# EasyEDA Pro project 通用F405飞控_2025-10-30.epro, board PCB1
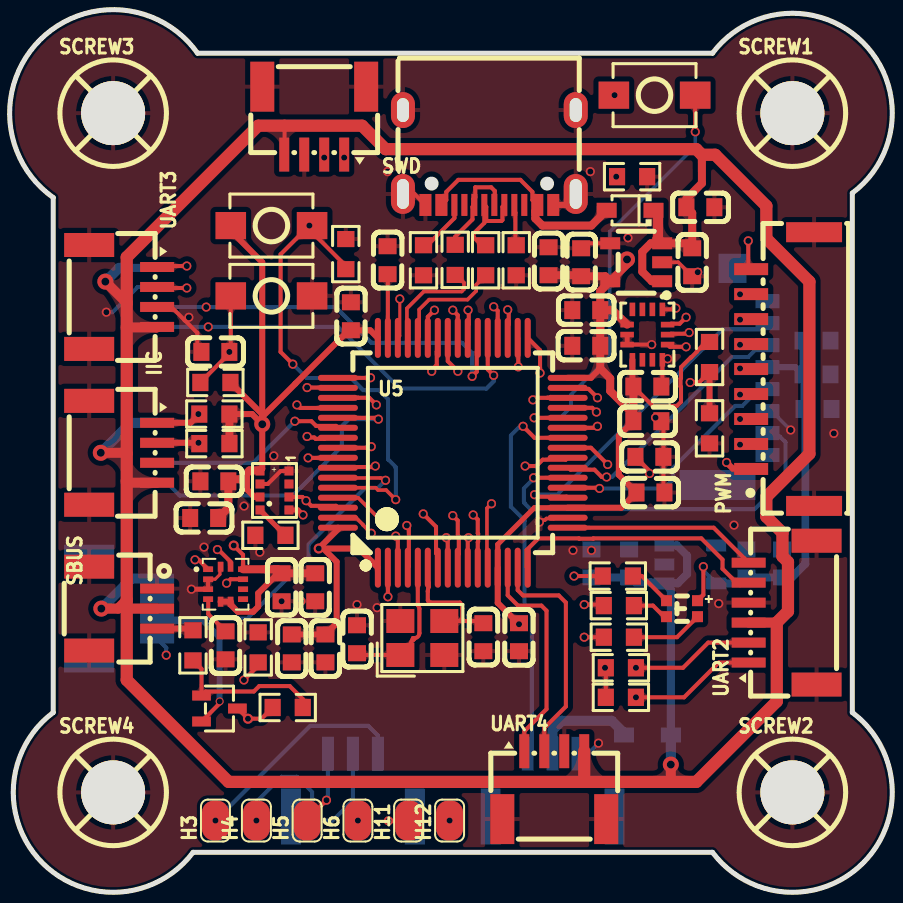
[diagram p5: board, top side]
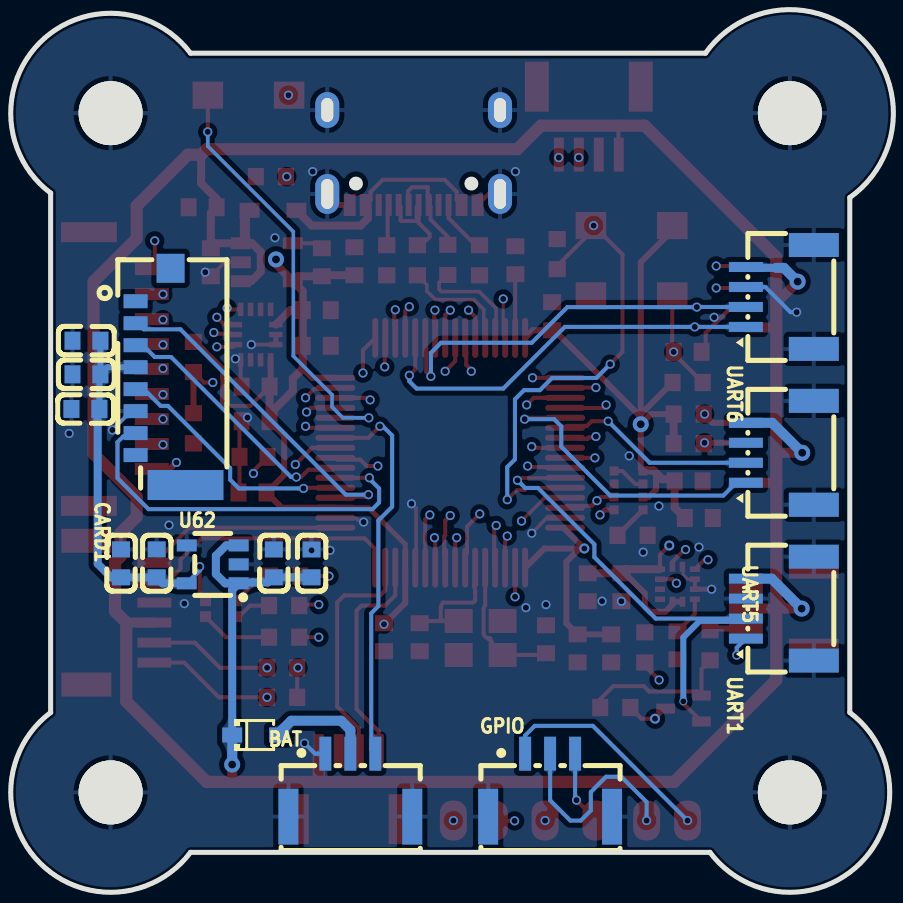
[diagram p6: board, bottom side, seen from below]

Outline 44.18 x 44.18 mm; copper layers: Top Layer, Inner1, Inner2, Bottom Layer. Coordinates in mm from the lower left corner of the outline.
Outline path: 2.18,34.77 arc(1.52,42.66) 9.41,42 35.18,42 arc(42.72,42.53) 42.18,35 42.18,9 arc(42.72,1.46) 35.18,2 9.18,2 arc(1.65,1.46) 2.18,9 2.18,34.77
Stack: Top Layer 0.035mm 外层铜厚1oz / Dielectric1 0.2104mm 7628 RC49% 8.6mil / Inner1 0.0152mm 内层铜厚 / Dielectric2 1.065mm 1.1mm H/HOZ Copper / Inner2 0.0152mm 内层铜厚 / Dielectric3 0.2104mm 7628 RC49% 8.6mil / Bottom Layer 0.035mm 外层铜厚1oz

## Design rules (mm)
net OSCOUT: DP1
net OSCIN: DP1
net OTG_FS_DM: DP3
net DM: DP2
net OTG_FS_DP: DP3
net DP: DP2
template: 自定义配置
spacing copperThickness1oz (default): track to track 0.102, other pairs 0.152 to 0.3
spacing copperThickness2oz: track to track 0.203, other pairs 0.152 to 0.3
track width copperThickness1oz (default): min 0.127, default 0.254, max 2.54
track width copperThickness2oz: min 0.203, default 0.254, max 2.54
differential pair differentialPair (default): width min 0.127, default 0.254, max 2.54; gap min 0.152, default 0.152
via viaSize (default): diameter min 0.254, default 0.457, max 10; hole min 0.3, default 0.305, max 6.299

## Placement (name value [footprint] x y rotation side)
BAT  WAFER-GH1.25-3PWB  [CONN-TH_3P-P1.25_GH1.25]  27.18 5.36 180 bottom
C1  10nF  [C0603]  28.87 29.14 0 top
C2  100nF  [C0603]  31.93 25.31 180 top
C3  2.2uF  [C0603]  31.93 23.58 180 top
C8  1uF  [C0603]  13.62 15.26 90 top
C9  100nF  [C0603]  15.3 15.26 90 top
C10  100nF  [C0603]  10.81 12.36 90 top
C12  100nF  [C0603]  17.08 28.83 270 top
C13  100nF  [C0603]  14.13 12.2 90 top
C14  100nF  [C0603]  15.81 12.2 90 top
C15  100nF  [C0603]  25.5 12.76 90 top
C16  100nF  [C0603]  32.08 20.01 180 top
C17  100nF  [C0603]  28.87 27.35 0 top
C20  2.2uF  [C0603]  18.92 31.63 270 top
C21  2.2uF  [C0603]  32.03 21.79 180 top
C42  30pF  [C0603]  23.71 12.76 270 top
C52  100nF  [C0603]  10.3 27.04 180 top
C70  30pF  [C0603]  17.39 12.66 270 top
C77  100nF  [C0603]  40.44 24.19 0 bottom
C78  100nF  [C0603]  34.17 31.53 90 top
C79  100nF  [C0603]  26.98 31.58 270 top
C80  10uF  [C0603]  28.61 31.53 270 top
C81  10uF  [C0603]  34.58 34.29 180 top
C82  100nF  [C0603]  29.13 16.46 270 bottom
C83  100nF  [C0603]  38.66 16.46 270 bottom
C84  10uF  [C0603]  36.88 16.46 270 bottom
C85  10uF  [C0603]  31.01 16.46 270 bottom
C86  100nF  [C0603]  9.74 18.73 0 top
C87  100nF  [C0603]  10.25 20.57 0 top
C88  100nF  [C0603]  40.39 25.92 180 bottom
C89  100nF  [C0603]  40.39 27.61 180 bottom
CARD1  TF-021B-H265  [TF-SMD_TF-021B-H265]  36.68 25.81 90 bottom
D1  1N5819WS  [SOD-323_L1.8-W1.3-LS2.5-RD]  31.93 7.87 180 bottom
D2  1N5819WS  [SOD-323_L1.8-W1.3-LS2.5-RD]  31.06 34.13 180 top
GPIO  WAFER-GH1.25-3PWB  [CONN-TH_3P-P1.25_GH1.25]  17.18 5.36 180 bottom
H3  -  [飞控微型焊盘]  10.3 3.59 90 top
H4  -  [飞控微型焊盘]  12.35 3.59 90 top
H5  -  [飞控微型焊盘]  14.89 3.59 90 top
H6  -  [飞控微型焊盘]  17.43 3.59 90 top
H11  -  [飞控微型焊盘]  19.97 3.59 90 top
H12  -  [飞控微型焊盘]  22.02 3.59 90 top
IIC  ZX-SH1.0-4PWT  [CONN-SMD_4P-P1.00_MEGASTAR_ZX-SH1.0-4PWT]  5.68 22 270 top
LED1  XL-2012RGBC  [LED-SMD_4P-L2.0-W1.3-BR]  33.66 14.19 0 top
PWM  WAFER-GH1.25-9PWB  [CONN-SMD_9P-P1.25_XUNPU_WAFER-GH1.25-9PWB]  38.69 26.19 90 top
Q1  SS8550(RANGE:200-350)  [SOT-323-3_L2.0-W1.3-P1.30-LS2.1-BR]  10.51 9.19 180 top
R1  10kΩ  [R0603]  16.83 31.94 90 top
R2  10kΩ  [R0603]  10.3 25.51 180 top
R3  1kΩ  [R0603]  31.16 35.82 0 top
R5  4.7kΩ  [R0603]  10.25 22.45 0 top
R6  4.7kΩ  [R0603]  10.25 23.93 0 top
R7  4.7kΩ  [R0603]  30.6 11.23 180 top
R8  4.7kΩ  [R0603]  30.6 9.76 180 top
R10  1kΩ  [R0603]  12.44 12.25 270 top
R12  150Ω  [R0603]  30.5 12.76 0 top
R13  150Ω  [R0603]  30.5 14.35 0 top
R14  150Ω  [R0603]  30.45 15.82 0 top
R19  5.1kΩ  [R0603]  20.72 31.63 90 top
R20  5.1kΩ  [R0603]  25.36 31.63 90 top
R21  1kΩ  [R0603]  13.92 9.25 0 top
R22  1kΩ  [R0603]  9.18 12.36 270 top
R23  22Ω  [R0603]  23.83 31.63 270 top
R24  22Ω  [R0603]  22.31 31.65 270 top
R25  10kΩ  [R0603]  13.06 17.86 0 top
R28  10kΩ  [R0603]  35.04 23.22 90 top
R29  1kΩ  [R0603]  35.04 26.79 270 top
SBUS  WAFER-SH1.0-3PWB  [CONN-SMD_3P-P1.00_WAFER-SH1.0-3PWB]  5.68 14.2 270 top
SCREW1  -  [M3螺丝]  39.18 39 0 top
SCREW2  -  [M3螺丝]  39.18 5 0 top
SCREW3  -  [M3螺丝]  5.18 39 0 top
SCREW4  -  [M3螺丝]  5.18 5 0 top
SW1  TS342A2P-WZ  [SW-SMD_L4.0-W2.9-LS5.0]  13.11 29.85 180 top
SW2  TS342A2P-WZ  [SW-SMD_L4.0-W2.9-LS5.0]  13.11 33.37 0 top
SW3  TS342A2P-WZ  [SW-SMD_L4.0-W2.9-LS5.0]  32.28 39.9 0 top
SWD  ZX-SH1.0-4PWT  [CONN-SMD_4P-P1.00_MEGASTAR_ZX-SH1.0-4PWT]  15.25 38.62 180 top
Typec  TYPE-C 16PIN 2MD(073)  [USB-C-SMD_TYPE-C-6PIN-2MD-073]  24.01 36.78 180 top
U1  ICM-42688-P  [LGA-14_L3.0-W2.5-P0.50-TL]  31.93 27.91 270 top
U4  LIS3MDLTR  [LGA-12_L2.0-W2.0-P0.50-BL]  10.81 15.42 270 top
U5  STM32F405RGT6  [LQFP-64_L10.0-W10.0-P0.50-LS12.0-BL]  22.18 22 0 top
U61  ME6217C33M5G  [SOT-23-5_L3.0-W1.7-P0.95-LS2.8-BR]  31.36 31.53 0 top
U62  ME6217C33M5G  [SOT-23-5_L3.0-W1.7-P0.95-LS2.8-BR]  34.07 16.41 180 bottom
U63  SPL06-001  [SENSOR-SMD_SPL06-001]  13.26 20.11 90 top
UART1  ZX-SH1.0-4PWT  [CONN-SMD_4P-P1.00_MEGASTAR_ZX-SH1.0-4PWT]  5.68 14.2 90 bottom
UART2  ZX-SH1.0-6PWT  [CONN-SMD_6P-P1.00_MEGASTAR_ZX-SH1.0-6PWT]  38.69 13.99 90 top
UART3  ZX-SH1.0-4PWT  [CONN-SMD_4P-P1.00_MEGASTAR_ZX-SH1.0-4PWT]  5.68 29.8 270 top
UART4  ZX-SH1.0-4PWT  [CONN-SMD_4P-P1.00_MEGASTAR_ZX-SH1.0-4PWT]  27.26 5.36 0 top
UART5  ZX-SH1.0-4PWT  [CONN-SMD_4P-P1.00_MEGASTAR_ZX-SH1.0-4PWT]  5.68 22 90 bottom
UART6  ZX-SH1.0-4PWT  [CONN-SMD_4P-P1.00_MEGASTAR_ZX-SH1.0-4PWT]  5.68 29.8 90 bottom
X3  12MHz  [CRYSTAL-SMD_4P-L3.2-W2.5-BL]  20.66 12.72 0 top

## Footprints (pads in the part's own frame, mm; a bottom-side part is the same pattern mirrored in y, then rotated)
C0603
  rect 0.8x0.9 smd: 1(-0.7,0) 2(0.7,0)
CONN-SMD_3P-P1.00_WAFER-SH1.0-3PWB
  rect 0.5x1.7 smd: 1(-1,1.7) 2(0,1.7) 3(1,1.7)
  rect 1.2x2.5 smd: 4(-2.1,-1.7) 5(2.1,-1.7)
CONN-SMD_4P-P1.00_MEGASTAR_ZX-SH1.0-4PWT
  rect 0.5x1.7 smd: 1(-1.5,1.7) 2(-0.5,1.7) 3(0.5,1.7) 4(1.5,1.7)
  rect 1.2x2.5 smd: 5(2.6,-1.7) 6(-2.6,-1.7)
CONN-SMD_6P-P1.00_MEGASTAR_ZX-SH1.0-6PWT
  rect 0.5x1.7 smd: 1(-2.5,1.7) 2(-1.5,1.7) 3(-0.5,1.7) 4(0.5,1.7) 5(1.5,1.7) 6(2.5,1.7)
  rect 1.2x2.5 smd: 7(3.6,-1.7) 8(-3.6,-1.7)
CONN-SMD_9P-P1.25_XUNPU_WAFER-GH1.25-9PWB
  rect 0.6x1.7 smd: 1(-5,1.575) 2(-3.75,1.575) 3(-2.5,1.575) 4(-1.25,1.575) 5(0,1.575) 6(1.25,1.575) 7(2.5,1.575) 8(3.75,1.575) 9(5,1.575)
  rect 1x2.8 smd: 10(6.85,-1.575) 11(-6.85,-1.575)
CONN-TH_3P-P1.25_GH1.25
  rect 0.6x1.7 smd: 1(-1.25,1.575) 2(0,1.575) 3(1.25,1.575)
  rect 1x2.8 smd: 4(3.1,-1.575) 5(-3.1,-1.575)
CRYSTAL-SMD_4P-L3.2-W2.5-BL
  rect 1.4x1.2 smd: 1(-1.1,-0.85) 2(1.1,-0.85) 3(1.1,0.85) 4(-1.1,0.85)
LED-SMD_4P-L2.0-W1.3-BR
  rect 0.55x0.55 smd: 1(0.775,-0.4) 2(-0.775,-0.4) 3(0.775,0.4) 4(-0.775,0.4)
LGA-12_L2.0-W2.0-P0.50-BL
  rect 0.28x0.5 smd: 1(-0.75,-0.875) 2(-0.25,-0.875) 3(0.25,-0.875) 4(0.75,-0.875) 7(0.75,0.875) 8(0.25,0.875) 9(-0.25,0.875) 10(-0.75,0.875)
  rect 0.5x0.28 smd: 5(0.875,-0.25) 6(0.875,0.25) 11(-0.875,0.25) 12(-0.875,-0.25)
LGA-14_L3.0-W2.5-P0.50-TL
  rect 0.675x0.28 smd: 1(-1.262,0.75) 2(-1.262,0.25) 3(-1.262,-0.25) 4(-1.262,-0.75) 8(1.262,-0.75) 9(1.262,-0.25) 10(1.262,0.25) 11(1.262,0.75)
  rect 0.28x0.675 smd: 5(-0.5,-1.012) 6(0,-1.012) 7(0.5,-1.012) 12(0.5,1.012) 13(0,1.012) 14(-0.5,1.012)
LQFP-64_L10.0-W10.0-P0.50-LS12.0-BL
  oval 0.3x2 smd: 1(-3.75,-5.75) 2(-3.25,-5.75) 3(-2.75,-5.75) 4(-2.25,-5.75) 5(-1.75,-5.75) 6(-1.25,-5.75) 7(-0.75,-5.75) 8(-0.25,-5.75) 9(0.25,-5.75) 10(0.75,-5.75) 11(1.25,-5.75) 12(1.75,-5.75) 13(2.25,-5.75) 14(2.75,-5.75) 15(3.25,-5.75) 16(3.75,-5.75) 33(3.75,5.75) 34(3.25,5.75) 35(2.75,5.75) 36(2.25,5.75) 37(1.75,5.75) 38(1.25,5.75) 39(0.75,5.75) 40(0.25,5.75) 41(-0.25,5.75) 42(-0.75,5.75) 43(-1.25,5.75) 44(-1.75,5.75) 45(-2.25,5.75) 46(-2.75,5.75) 47(-3.25,5.75) 48(-3.75,5.75)
  oval 2x0.3 smd: 17(5.75,-3.75) 18(5.75,-3.25) 19(5.75,-2.75) 20(5.75,-2.25) 21(5.75,-1.75) 22(5.75,-1.25) 23(5.75,-0.75) 24(5.75,-0.25) 25(5.75,0.25) 26(5.75,0.75) 27(5.75,1.25) 28(5.75,1.75) 29(5.75,2.25) 30(5.75,2.75) 31(5.75,3.25) 32(5.75,3.75) 49(-5.75,3.75) 50(-5.75,3.25) 51(-5.75,2.75) 52(-5.75,2.25) 53(-5.75,1.75) 54(-5.75,1.25) 55(-5.75,0.75) 56(-5.75,0.25) 57(-5.75,-0.25) 58(-5.75,-0.75) 59(-5.75,-1.25) 60(-5.75,-1.75) 61(-5.75,-2.25) 62(-5.75,-2.75) 63(-5.75,-3.25) 64(-5.75,-3.75)
M3螺丝
  round 3.2 hole 3.2: 1(0,0)
R0603
  rect 0.806x0.864 smd: 1(-0.753,0) 2(0.753,0)
SENSOR-SMD_SPL06-001
  rect 0.45x0.45 smd: 1(0.975,-0.725) 2(0.325,-0.725) 3(-0.325,-0.725) 4(-0.975,-0.725) 5(-0.975,0.725) 6(-0.325,0.725) 7(0.325,0.725) 8(0.975,0.725)
SOD-323_L1.8-W1.3-LS2.5-RD
  rect 1x0.75 smd: 1(-1.173,0) 2(1.173,0)
SOT-23-5_L3.0-W1.7-P0.95-LS2.8-BR
  rect 1x0.6 smd: 1(1.3,-0.95) 2(1.3,0) 3(1.3,0.95) 4(-1.3,0.95) 5(-1.3,-0.95)
SOT-323-3_L2.0-W1.3-P1.30-LS2.1-BR
  rect 0.936x0.5 smd: 1(0.898,-0.65) 2(0.898,0.65) 3(-0.898,0)
SW-SMD_L4.0-W2.9-LS5.0
  rect 1.53x1.36 smd: 1(-2.035,0) 2(2.035,0)
TF-SMD_TF-021B-H265
  rect 0.7x1.2 smd: 1(3.775,1.25) 2(2.675,1.25) 3(1.575,1.25) 4(0.475,1.25) 5(-0.625,1.25) 6(-1.725,1.25) 7(-2.825,1.25) 8(-3.925,1.25)
  rect 1.5x3.8 smd: 9(-5.425,-1.25)
  rect 1.45x1.4 smd: 10(5.425,-0.5)
USB-C-SMD_TYPE-C-6PIN-2MD-073
  rect 0.6x1.1 smd: 1(-3.2,2.375) 2(-2.4,2.375) 11(2.4,2.375) 12(3.2,2.375)
  rect 0.3x1.1 smd: 3(-1.75,2.375) 4(-1.25,2.375) 5(-0.75,2.375) 6(-0.25,2.375) 7(0.25,2.375) 8(0.75,2.375) 9(1.25,2.375) 10(1.75,2.375)
  oval 1.2x2 hole 0.6x1.5: 13(-4.325,1.825) 14(4.325,1.825)
  oval 1.2x1.8 hole 0.6x1.2: 13(-4.325,-2.375) 14(4.325,-2.375)
飞控微型焊盘
  rrect 2x1.35 smd: 1(0,0)

## Nets
As in the schematic.

Pads without a net: CARD1 1 8 9 10; Typec 3 9; U1 2 3 4 9 10; U4 7 8; U63 2

## Via types
v1: diameter 0.8, hole 0.4, Top Layer to Bottom Layer, 6 vias
v2: diameter 0.5, hole 0.3, Top Layer to Bottom Layer, 3 vias
v3: diameter 0.457, hole 0.305, Top Layer to Bottom Layer, 123 vias
v4: diameter 0.4, hole 0.299, Top Layer to Bottom Layer, 1 via

## Routing (per net, layer and track width the routed paths; a pad name or vN(x,y) marks a point on that pad's centre or on a via; arc(x,y) is an arc through that point)
3V3_MCU: length 152.1
  Top Layer w0.203: R21.1 12.61,8.68 v2(11.93,8.68) 11.42,9.19 11.4,9.19 ; R29.1 34.99,27.49 34.82,27.49 34.4,27.07 34.4,27.05 34.11,26.77 34.1,26.77 33.61,26.28 33.61,25.74 33.59,25.71 33.59,25.31 33.61,25.29 33.61,24.55 33.4,24.34 32.19,24.34 31.23,25.31 ; U4.10 11.69,16.89 v2(11.22,17.35) ; C16.2 31.38,20.15 ; R7.2 R8.2
  Top Layer w0.25: U5.19 26.27,19.25 24.43,17.41 U5.13
  Top Layer w0.3: U63.8 12.65,21.2 v1(12.65,23.42) ; 27.93,25.75 29.1,25.75 29.57,26.21 ; 12.65,23.79 14.31,25.45 14.31,25.46 16.98,28.13 C12.2 18.05,28.13 U5.48 ; 12.65,23.79 v1(12.65,23.42) ; 12.65,23.79 12.65,23.92 ; 15.7,17.2 v2(15.47,17.2) 16.43,18.17 U5.64 ; 15.7,17.2 17.48,17.2 U5.1 ; 15.7,17.2 16.37,16.54 16.37,13.46 C14.2 C13.2 ; SW2.1 11.07,33.11 12.65,31.53 12.65,23.92 ; v1(12.65,23.42) 12.14,23.93 R6.2 ; U63.6 12.26,19.78 11.88,20.16 11.88,20.98 ; v3(25.5,13.41) 24.43,14.48 U5.13 ; U4.5 U4.6 11.06,14.4 11.42,14.04 12.19,14.04 12.44,14.29 12.44,14.96 13.44,15.96 C8.2 ; 12.65,23.92 R2.1 ; U5.19 30.62,19.25 C16.2 30.5,20.89 30.5,22.85 31.23,23.58 ; 31.23,25.31 31.18,25.36 U1.8
  Top Layer w0.4: U4.10 13.41,16.17 C8.2 C9.2 ; 31.23,23.58 31.23,23.93 ; 31.23,23.93 30.06,25.09 30.06,25.72 29.57,26.21 C17.2 C1.2 ; 31.23,23.93 31.23,25.31 ; U61.5 30.91,31.43 v1(30.91,31.67) ; U61.5 29.81,30.83 C80.2 28.56,30.88 C79.2 ; U61.5 29.57,30.08 C1.2 ; U1.5 30.19,29.14 C1.2 ; U63.8 12.51,21.11 12.01,21.11 11.88,20.98 11.57,20.67 11.05,20.67 C87.2 10.95,19.24 C86.2 ; R6.2 R5.2
  Inner1 w0.3: v3(25.5,13.41) 26.84,13.41 28.36,11.9 29.14,11.9 v3(29.8,11.23) ; v1(12.65,23.42) 12.65,18.78 v2(11.22,17.35) ; v2(11.93,8.68) 15.47,12.22 v2(15.47,17.2)
  Inner1 w0.4: v1(12.65,23.42) 13.87,22.2 13.87,17.92 14.32,17.47 15.21,17.47 v2(15.47,17.2)
  Inner1 w0.5: v1(12.65,23.42) 12.65,26.38 18.31,32.04 30.44,32.04 30.81,31.67 v1(30.91,31.67)
3V3_PER: length 20.9
  Top Layer w0.203: 34.43,14.59 34.73,14.88 v3(34.73,16.3)
  Bottom Layer w0.203: v3(34.73,16.3) 34.73,16.11 U62.5
  Bottom Layer w0.3: CARD1.4 39.33,26.28 C88.2 ; C77.1 39.74,25.87 C88.2 ; C88.2 C89.2
  Bottom Layer w0.4: U62.5 36.58,15.46 C84.2 C83.2 39.15,15.76 39.83,16.44 39.83,24.1 C77.1
5V: length 173.6
  Top Layer w0.203: 13.76,38.37 13.76,36.94 SWD.4
  Top Layer w0.4: U61.1 32.15,30.58 31.67,31.06 31.67,32.05 32.1,32.48 U61.3 33.92,32.48 34.17,32.23 34.17,33.99 C81.2 33.88,34.71 34.65,35.49 34.65,36.91
  Top Layer w0.5: 33.08,5.52 33.1,5.54 v1(33.1,6.39) ; v1(4.57,22) 5.83,22 5.86,21.96 ; 5.86,20.56 5.93,20.5 IIC.4 ; UART3.4 7.36,28.27 5.86,28.27 ; U61.3 32.46,32.69 32.46,33.9 D2.1 ; SBUS.2 5.89,14.2 5.86,14.17 ; v1(4.59,14.2) 5.43,14.2 5.86,14.63 ; v1(4.79,30.56) 5.86,29.49 ; UART2.3 38.4,13.49
  Top Layer w0.61: 28.76,5.52 34.37,5.52 38.4,9.55 38.4,13.5 38.96,14.06 38.96,16.53 38.69,16.81 38.69,17.99 37.88,18.8 37.88,19.79 40.03,21.94 40.03,30.56 37.88,32.72 37.88,34.35 35.32,36.91 34.65,36.91 34.37,37.19 18.82,37.19 17.65,38.37 12.44,38.37 5.86,31.79 5.86,10.62 10.96,5.52 28.76,5.52 ; 28.76,5.52 UART4.4
  Bottom Layer w0.4: U62.1 33.45,15.46 33.91,15.93 33.91,16.84 33.4,17.36 U62.3 ; U62.1 32.73,15.5 32.08,15.5 32.07,15.51 31.32,15.51 31.06,15.76 C85.2 C82.2 ; U62.1 33.1,15.13 D1.1 ; UART6.4 7.34,31.25 5.86,31.25
  Bottom Layer w0.5: UART1.4 6.09,15.7 v1(4.59,14.2) ; v1(4.79,30.56) 5.48,31.25 5.86,31.25 ; v1(4.57,22) 6.07,23.5 UART5.4 ; D1.1 v1(33.1,6.39)
5V_USB: length 10.7
  Top Layer w0.203: Typec.2 26.17,34.65 26.17,35.06 25.57,35.66 22.46,35.66 21.86,35.06 21.86,34.65 Typec.11
  Top Layer w0.4: 26.32,34.09 26.32,34.09 26.32,33.73 26.67,33.37 29.12,33.37 D2.2
GND: length 33.4
  Top Layer w0.15: U4.2 10.29,15.67 10.53,15.91 10.53,16.15
  Top Layer w0.18: v3(18.1,17.97) 17.68,18.39 17.68,18.41 17.34,18.75 U5.63 ; v3(26.52,18.53) 26.62,18.63 26.79,18.63 26.87,18.71 27.25,18.71 27.29,18.75 27.93,18.75 U5.18 ; C78.1 33.47,31.53 U61.2 ; U5.12 23.89,16.29 23.89,19.22 v3(24.12,19.45)
  Top Layer w0.203: C3.1 32.73,23.47 32.73,20.06 C16.1 ; Typec.14 20.26,34.95 Typec.12 ; U1.7 v3(32.14,27.41) ; 8.77,28.63 8.14,29.26 7.68,29.26 7.64,29.3 UART3.3 ; 8.77,28.63 9.4,28 9.4,27.25 C52.2 ; 8.77,28.63 8.92,28.78 v3(8.98,28.78) ; 28.61,32.23 28.86,32.48 U61.4 ; C2.1 32.68,25.36 U1.11 32.89,26.65 v3(32.94,26.7) ; U63.7 12.92,20.43 13.57,21.08 U63.1 ; U4.2 U4.3
  Top Layer w0.25: U1.6 U1.7 ; v3(9.1,15.17) U4.3
  Top Layer w0.3: Typec.1 27.79,34.4 Typec.13
  Bottom Layer w0.18: 38.95,23.28 38.15,24.08 37.93,24.08
  Bottom Layer w0.203: UART6.3 6.41,30.3 5.15,29.03 v3(4.84,29.03) ; v3(29.48,7.46) 28.95,6.93 BAT.1
  vias: v3(9.73,17.27) v3(11.74,19.33) v3(12.53,17.02) v3(13.22,21.84) v3(13.62,14.56) v3(14.58,14.57) v3(17.39,14.4) v3(18.4,14.24) v3(18.92,36.07) v3(28.2,17.11) v3(29.07,36.07) v3(29.13,17.11) v3(30.96,32.76) v3(32.33,23.76) v3(34.45,31.04) v3(35.5,14.45) v3(36.26,18.37) v3(39.1,23.14) v3(41.26,22.96)
ADC1: length 19.7
  Top Layer w0.203: U5.26 26.28,22.75 v3(25.7,23.32)
  Bottom Layer w0.203: BAT.3 26.14,7.14 26.14,13.96 25.78,14.32 25.78,18.6 25.09,19.29 25.09,22.86 25.55,23.32 v3(25.7,23.32)
ADC2: length 10.3
  Top Layer w0.203: v3(29.43,23.32) 29.35,23.25 U5.27 ; v3(34.07,25.51) 34.51,25.51 R29.2
  Top Layer w0.3: R28.2 R29.2
  Inner1 w0.203: v3(34.07,25.51) 33.76,25.51 32.49,24.24 30.34,24.24 v3(29.43,23.32)
BOOT0: length 24.5
  Top Layer w0.18: v3(19.33,19.65) 18.85,20.13 18.44,20.13 18.33,20.25 U5.60
  Top Layer w0.203: v3(15.01,33.37) 13.57,31.93 13.57,27.04 v3(14.18,26.43) ; SW2.2 15.14,33.04 16.83,31.35 R1.1
  Bottom Layer w0.203: v3(14.18,26.43) 14.87,25.74 17.08,25.74 17.7,25.13 18.49,25.13 18.94,24.68 18.94,21.67 19.33,21.28 v3(19.33,19.65)
BUTTON1: length 21.9
  Top Layer w0.203: v3(34.32,38.06) 34.32,38.07 SW3.2 ; U5.28 v3(26.26,23.75)
  Bottom Layer w0.18: v3(26.26,23.75) 27.56,23.75 28.1,24.29 28.1,24.9 30.04,26.84 30.04,33.06 34.32,37.35 v3(34.32,38.06)
DM: length 5.1
  Top Layer w0.203: Typec.5 24.67,34.31 24.67,33.64 24.62,33.6 23.86,33.6 23.86,34.31 Typec.7 23.76,33.51 23.22,32.96 23.22,32.8 23.63,32.39 R23.1
DP: length 5.1
  Top Layer w0.203: Typec.6 24.26,34.5 24.29,34.53 24.29,35.1 24.1,35.29 23.31,35.29 23.31,34.79 23.21,34.7 23.21,34.45 Typec.8 23.17,34.31 23.17,33.68 22.31,32.81 R24.1
F5V: length 5.3
  Bottom Layer w0.5: D1.2 30.75,7.97 30.14,8.58 27.64,8.58 27.18,8.13 BAT.2
GPIO1: length 31.7
  Top Layer w0.203: U5.8 21.93,17.67 v3(21.86,17.75)
  Inner2 w0.203: v3(10.3,3.59) 21.86,15.14 v3(21.86,17.75)
  Bottom Layer w0.203: GPIO.1 18.43,7.84 17.95,8.33 15.05,8.33 v3(10.3,3.59)
GPIO2: length 32.8
  Top Layer w0.203: v3(22.18,18.85) 22.43,18.6 22.43,17.86 22.49,17.81 22.49,16.93 22.43,16.88 U5.9
  Inner2 w0.203: v3(12.35,3.59) 22.43,13.67 22.43,17.76 22.34,17.85 22.34,17.95 22.18,18.1 v3(22.18,18.85)
  Bottom Layer w0.203: GPIO.2 17.18,4.6 16.17,3.59 15.65,3.59 15.15,4.09 15.15,5.01 14.38,5.78 13.62,5.78 12.35,4.52 v3(12.35,3.59)
GPIO3: length 21.4
  Top Layer w0.203: v3(15.86,4.61) 14.89,3.64 H5.1 ; v3(22.97,17.75) 22.93,17.71 U5.10
  Inner2 w0.203: v3(22.97,17.75) 22.97,11.71 v3(15.86,4.61)
  Bottom Layer w0.203: v3(15.86,4.61) 15.93,4.68 GPIO.3
GPIO4: length 20.6
  Top Layer w0.203: U5.11 23.43,17.53 23.45,17.55 23.45,17.95 23.43,17.97 23.43,18.65 v3(23.2,18.88)
  Inner2 w0.203: v3(23.2,18.88) 23.2,18.2 23.45,17.95 23.45,9.61 v3(17.43,3.59)
GPIO5: length 24.9
  Top Layer w0.203: v3(18.96,3.57) 19.96,3.57 H11.1 ; v3(25.81,21.33) 26.37,21.33 26.68,21.65 27.84,21.65 U5.24
  Inner2 w0.203: v3(25.81,21.33) 25.09,20.62 25.09,15.57 26.32,14.35 26.32,10.93 v3(18.96,3.57)
GPIO6: length 24
  Top Layer w0.203: v3(29.94,21.41) 29.1,22.25 U5.25
  Inner2 w0.203: v3(22.02,3.59) 27.69,9.25 27.69,20.16 28.94,21.41 v3(29.94,21.41)
I2C1_SCL: length 28.8
  Top Layer w0.18: U5.61 17.45,19.75 v3(18.61,18.58)
  Top Layer w0.203: U4.1 9.46,16.64 v3(9.28,16.64)
  Top Layer w0.25: U63.4 14.44,19.13 v3(14.69,18.88)
  Top Layer w0.3: IIC.2 v3(9.46,22.5) R5.1
  Inner1 w0.25: v3(14.69,18.88) 18.31,18.88 v3(18.61,18.58)
  Inner1 w0.3: v3(9.46,22.5) 9.2,22.24 9.2,17.05 9.28,16.97 v3(9.28,16.64)
  Inner2 w0.203: v3(18.61,18.58) 16.83,20.36 14.53,20.36 14.28,20.11 11.63,20.11 9.23,17.71 9.23,16.69 v3(9.28,16.64)
I2C1_SDA: length 19.7
  Top Layer w0.203: v3(10.4,17.15) 10.45,17.15 11.06,16.54 U4.11 ; U63.3 14.66,19.78 v3(14.84,19.6) 15.1,19.34 16.34,19.34 U5.62
  Top Layer w0.3: R6.1 9.06,23.5 IIC.1
  Inner1 w0.3: v3(9.45,23.93) 10.4,22.98 v3(10.4,17.15)
  Inner2 w0.203: v3(10.4,17.15) 10.3,17.25 10.3,18.02 10.86,18.58 13.92,18.58 14.1,18.76 14.1,19.14 14.62,19.65 14.79,19.65 v3(14.84,19.6)
I2C2_SCL: length 21.8
  Top Layer w0.203: v3(29.38,24.04) 29.17,24.25 U5.29 ; v3(31.35,11.23) 33.71,11.23 34.97,12.49 UART2.2
  Inner2 w0.203: v3(31.35,11.23) 31.35,22.93 30.24,24.04 v3(29.38,24.04)
I2C2_SDA: length 26.1
  Top Layer w0.203: v3(26.19,24.64) 26.3,24.75 26.91,24.75 26.92,24.75 27.93,24.75 U5.30 ; v3(31.35,9.76) 33.76,9.76 35.5,11.49 UART2.1
  Inner2 w0.203: v3(26.19,24.64) 28.33,22.51 29.83,22.51 30.6,21.74 30.6,10.51 v3(31.35,9.76)
LED1: length 13.1
  Top Layer w0.203: U5.2 18.94,16.24 v3(18.94,14.79) ; v3(28.76,12.76) R12.1
  Inner1 w0.203: v3(28.76,12.76) 26.74,14.79 v3(18.94,14.79)
LED2: length 13.5
  Top Layer w0.203: v3(28.76,14.4) 29.69,14.4 R13.1 ; U5.3 19.43,17.72 v3(19.33,17.83)
  Inner1 w0.203: v3(28.76,14.4) 28.66,14.4 26.52,16.54 20.62,16.54 v3(19.33,17.83)
LED3: length 13
  Top Layer w0.203: U5.4 19.99,16.3 19.99,18.26 v3(19.88,18.36) ; v3(28.25,15.82) R14.1
  Inner1 w0.203: v3(28.25,15.82) 25.72,18.36 v3(19.88,18.36)
LIS_ADDR: length 7.3
  Top Layer w0.203: R10.2 12.44,11.34 v3(11.73,10.62) ; U4.9 11.06,15.67 v3(10.86,15.47)
  Inner1 w0.203: v3(11.73,10.62) 10.86,11.49 v3(10.86,15.47)
NRST: length 22.4
  Top Layer w0.203: U5.7 21.43,16.88 21.35,16.97 21.35,18.3 v3(20.71,18.94) ; R2.2 11,26.97 v3(11,27.04) 11.07,27.11 SW1.2
  Inner2 w0.203: v3(20.71,18.94) 20.77,19 20.77,19.55 18.51,21.82 17.67,21.82 17.26,22.22 14.26,22.22 13.72,22.76 13.72,24.33 v3(11,27.04)
OSCIN: length 7.2
  Top Layer w0.203: C70.2 17.48,11.87 X3.1 20,12.32 20.19,12.72 20.19,12.61 20.26,12.68 20.26,12.72 arc(20.44,12.79) 20.51,12.97 20.51,14.17 arc(20.49,14.28) 20.43,14.36 U5.5
OSCOUT: length 7.1
  Top Layer w0.203: U5.6 20.93,15.59 arc(20.98,15.46) 20.98,15.32 20.97,15.28 arc(20.97,15.27) 20.97,15.26 20.94,15.12 20.94,15.08 arc(20.94,15.06) 20.93,15.04 20.93,14.61 arc(20.94,14.6) 20.96,14.6 ; 22.45,13.57 23.6,13.57 23.71,13.46 ; 22.45,13.57 X3.3 arc(21.77,13.57) 21.78,13.57 22.38,13.57 arc(22.42,13.57) 22.45,13.57 ; 22.45,13.57 arc(22.56,13.61) 22.66,13.68 22.66,14.22 arc(22.63,14.37) 22.54,14.5 21.08,14.5 arc(21.02,14.51) 20.96,14.55
OTG_FS_DM: length 5.7
  Top Layer w0.18: R23.2 23.36,30.41 23.36,30.1 22.92,29.66 21,29.66 20.5,29.16 20.5,27.81 U5.44
OTG_FS_DP: length 5.7
  Top Layer w0.18: R24.2 22.36,30.9 22.75,30.51 22.75,30.18 22.63,30.07 20.73,30.07 19.89,29.22 19.89,27.84 19.93,27.8 U5.45
SBUS: length 1.8
  Top Layer w0.3: SBUS.3 9.09,13.2 R22.1
SDCARD_CS: length 16.9
  Top Layer w0.203: v3(26.28,19.9) 26.38,19.8 27.88,19.8 U5.20
  Bottom Layer w0.203: v3(26.28,19.9) 27.41,19.9 35.69,28.18 37.53,28.18 37.83,28.48 CARD1.2
SPI1_MISO: length 19.9
  Top Layer w0.203: v3(26.23,20.75) U5.22
  Bottom Layer w0.203: CARD1.7 37.99,22.98 38.15,22.81 38.56,22.81 38.84,22.53 38.84,20.73 37.29,19.17 26.08,19.17 25.75,19.5 25.75,19.54 25.74,19.55 25.74,20.21 26.23,20.69 v3(26.23,20.75)
SPI1_MOSI: length 12.9
  Top Layer w0.203: v3(29.89,20.78) 29.64,20.78 29.28,21.15 28.08,21.15 27.99,21.25 U5.23
  Bottom Layer w0.203: v3(29.89,20.78) 30.15,20.78 36.16,26.79 36.97,26.79 37.51,27.33 37.88,27.33 CARD1.3
SPI1_SCK: length 12.4
  Top Layer w0.203: U5.21 29.49,20.25 v3(29.53,20.21)
  Bottom Layer w0.203: v3(29.53,20.21) 32.76,20.21 33.2,20.65 33.2,21.23 36.31,24.34 36.68,24.34 37.51,25.18 CARD1.5
SPI2_CS: length 11.4
  Top Layer w0.203: v3(33.86,27.3) 33.05,27.3 U1.12 ; U5.33 26.55,27.13 v3(26.55,25.99)
  Inner1 w0.203: v3(33.86,27.3) 33.97,27.2 33.97,26.99 32.71,25.74 26.81,25.74 v3(26.55,25.99)
SPI2_MISO: length 11.2
  Top Layer w0.203: v3(33.35,29.24) 33.29,29.17 U1.1 ; v3(24.93,29.15) 24.93,29.07 24.99,29.02 24.99,28.43 24.93,28.38 U5.35
  Inner1 w0.203: v3(24.93,29.15) 24.93,28.9 25.26,28.57 31.82,28.57 32.49,29.24 v3(33.35,29.24)
SPI2_MOSI: length 14.3
  Top Layer w0.203: v3(33.86,28.78) 33.54,28.46 33.11,28.46 33.07,28.41 U1.14 ; v3(24.23,29.31) 24.43,29.1 U5.36
  Inner1 w0.203: v3(24.23,29.31) 24.03,29.1 24.03,28.06 24.23,27.86 31.93,27.86 32.79,28.73 33.81,28.73 v3(33.86,28.78)
SPI2_SCK: length 11.9
  Top Layer w0.203: U5.34 25.46,27.72 v3(25.46,26.3) ; v3(34.02,28.01) 33.96,27.95 33.11,27.95 33.07,27.91 U1.13
  Inner1 w0.203: v3(34.02,28.01) 33.97,27.96 33.51,27.96 32.23,26.69 26.52,26.69 26.03,26.19 25.56,26.19 v3(25.46,26.3)
SWCLK: length 13.2
  Top Layer w0.203: U5.49 18.06,25.75 v3(18.07,25.75)
  Inner2 w0.203: v3(18.07,25.75) 17.14,26.68 17.14,36.38 v3(16.75,36.77)
SWDIO: length 12.5
  Top Layer w0.15: U5.46 19.53,27.84 v3(19.53,29.7)
  Inner2 w0.18: v3(19.53,29.7) 19.58,29.75 19.58,33.24 17.75,35.08 17.75,36.87 17.12,37.5 16.47,37.5 v3(15.75,36.77)
TIM1_CH1: length 19.3
  Top Layer w0.203: U5.41 21.93,26.58 v3(22.44,26.08)
  Top Layer w0.3: PWM.1 36.71,21.19 36.69,21.21 36.2,21.21 v3(35.89,21.51)
  Inner2 w0.203: v3(35.89,21.51) 30.56,26.84 23,26.84 22.44,26.28 v3(22.44,26.08)
TIM1_CH2: length 20.3
  Top Layer w0.203: U5.42 21.43,27.11 21.38,27.06 21.38,26.4 21.13,26.14 v3(21.13,26.08)
  Inner2 w0.203: v3(36.56,22.4) 36.36,22.4 31.46,27.3 21.52,27.3 21.03,26.81 21.03,26.18 v3(21.13,26.08)
TIM1_CH3: length 32.9
  Top Layer w0.203: U5.43 20.93,28.8 v3(21.27,29.14)
  Inner1 w0.203: v3(36.56,23.69) 38.21,23.69 39.37,24.85 39.37,32.86 38.91,33.32 35.95,33.32 33.56,30.92 23.05,30.92 v3(21.27,29.14)
TIM2_CH1: length 29.4
  Top Layer w0.203: v3(14.89,25.26) 16.42,25.26 U5.50
  Inner1 w0.203: v3(14.89,25.26) 14.92,25.23 29.63,25.23 29.64,25.22 32.9,25.22 35.6,27.91 37.18,27.91 37.84,27.25 37.84,25.26 37.44,24.86 36.61,24.86 v3(36.56,24.91)
TIM2_CH2: length 24.7
  Top Layer w0.203: U5.55 16.38,22.75 16.37,22.76 15.82,22.76 15.75,22.69 15.32,22.69 15.25,22.76 14.94,22.76 v3(14.89,22.81)
  Inner1 w0.203: v3(36.56,26.22) 35.94,26.22 32.54,22.81 v3(14.89,22.81)
TIM3_CH1: length 24.2
  Top Layer w0.203: v3(18.1,22.3) 18.05,22.25 U5.56
  Inner1 w0.203: v3(36.56,27.4) 36.56,27.3 36.59,27.28 36.59,27.23 37.1,26.71 37.1,25.66 36.99,25.54 36.52,25.54 36.37,25.39 36.36,25.39 36.08,25.11 36.08,25.1 33.31,22.33 18.28,22.33 18.16,22.2 18.1,22.2 v3(18.1,22.3)
TIM3_CH2: length 32.2
  Top Layer w0.203: v3(14.94,21.74) 16.43,21.74 U5.57
  Inner1 w0.203: v3(36.56,28.66) 36.56,28.71 36.66,28.81 37.63,28.81 38.63,27.82 38.63,24.91 38.03,24.32 36.46,24.32 36.01,23.86 36.01,23.58 34.32,21.89 18.38,21.89 18.3,21.82 17.9,21.82 17.83,21.89 15.04,21.89 14.94,21.79 v3(14.94,21.74)
TIM3_CH3: length 15.4
  Top Layer w0.203: U5.39 22.95,27.76 22.95,28.39 22.99,28.43 22.99,29 22.95,29.04 v3(22.95,29.14)
  Inner1 w0.203: v3(36.56,29.93) 36.42,29.79 23.5,29.79 22.95,29.24 v3(22.95,29.14)
TIM3_CH4: length 19.6
  Top Layer w0.203: PWM.9 36.97,31.33 v3(36.97,32.6) ; v3(22.18,29.14) 22.43,28.89 U5.40
  Inner1 w0.203: v3(22.19,29.13) 22.19,29.31 23.29,30.41 35.29,30.41 36.97,32.09 36.97,32.6
UART1_RX: length 25.3
  Top Layer w0.18: U5.59 16.45,20.75 16.47,20.74 18.57,20.74 18.8,20.66 v3(18.82,20.62)
  Top Layer w0.203: Q1.2 10.52,9.45 10.52,9.51 ; 18.82,20.72 v3(18.82,20.62)
  Bottom Layer w0.203: UART1.2 11.9,13.7 14.97,16.77 14.97,17.41 17.79,20.23 18.43,20.23 v3(18.82,20.62)
  Bottom Layer w0.3: UART1.2 7.5,13.58 9.69,13.58 10.52,12.75 v4(10.52,9.55)
UART1_TX: length 20.7
  Top Layer w0.203: v3(18.31,21.33) 18.26,21.28 16.52,21.28 16.49,21.25 U5.58
  Inner2 w0.203: v3(7.84,11.87) 7.84,12.12 7.76,12.2 7.76,12.4 8.44,13.08 8.44,18.2 11.5,21.25 18,21.25 18.08,21.33 v3(18.31,21.33)
  Bottom Layer w0.203: UART1.1 7.84,12.24 v3(7.84,11.87)
UART2_RX: length 9.8
  Top Layer w0.203: U5.17 35.24,18.25 UART2.6
UART2_TX: length 13.5
  Top Layer w0.203: UART2.5 36.89,15.49 36.84,15.55 36.33,15.55 35.69,16.19 35.69,16.65 34.62,17.71 29.22,17.71 29.21,17.69 28.52,17.69 28.5,17.71 26.47,17.71 25.88,17.13 25.88,16.29 25.93,16.25 U5.16
UART3_RX: length 15.9
  Top Layer w0.203: UART3.2 7.44,30.24 v3(8.87,30.24) ; v3(14.38,24.39) 14.53,24.24 16.43,24.24 U5.52
  Inner2 w0.203: v3(14.38,24.39) 14.48,24.29 15.91,24.29 16.29,24.67 16.29,25.34 11.49,30.14 8.97,30.14 v3(8.87,30.24)
UART3_TX: length 16
  Top Layer w0.203: U5.51 16.44,24.75 17.45,24.75 17.45,24.75 18,24.75 v3(18.36,24.39) ; UART3.1 7.43,31.34 v3(8.87,31.34)
  Inner2 w0.203: v3(18.36,24.39) 18.16,24.39 11.2,31.34 v3(8.87,31.34)
UART4_RX: length 11.7
  Top Layer w0.203: UART4.2 26.76,8.22 27.85,9.3 27.85,14.5 27.49,14.86 25.7,14.86 25.43,15.12 U5.15
UART4_TX: length 11.1
  Top Layer w0.203: U5.14 24.93,14.86 25.45,14.35 26.62,14.35 26.88,14.09 26.88,9.16 25.76,8.05 UART4.1
UART5_RX: length 10
  Top Layer w0.203: v3(14.28,23.58) 15.11,23.58 15.34,23.34 16.34,23.34 U5.54
  Bottom Layer w0.203: v3(14.28,23.58) 12.2,21.5 UART5.2
UART5_TX: length 15.6
  Top Layer w0.203: v3(18.46,23.68) 18.39,23.75 U5.53
  Bottom Layer w0.203: v3(18.46,23.68) 16.98,23.68 16.63,23.32 16.63,22.3 14.18,19.85 8.51,19.85 7.87,20.5 UART5.1
UART6_RX: length 19.9
  Top Layer w0.203: U5.38 23.43,27.11 23.38,27.06 23.38,26.05 v3(23.15,25.82)
  Bottom Layer w0.203: UART6.2 9.84,29.3 v3(9.84,29.29) 16.32,29.29 18.1,27.5 22.64,27.5 23.15,26.99 v3(23.15,25.82)
UART6_TX: length 20.6
  Top Layer w0.203: U5.37 23.93,26.17 v3(24.23,25.87)
  Bottom Layer w0.203: v3(24.23,25.87) 24.23,25.57 23.87,25.21 19.53,25.21 16.44,28.3 v3(9.94,28.3) UART6.1
$1N2558: length 2
  Top Layer w0.203: C10.2 9.94,13.92 9.94,14.66 U4.4
$1N22340: length 3.2
  Top Layer w0.203: C20.2 18.93,30.92 U5.47
$1N22341: length 8.4
  Top Layer w0.203: v3(32.04,20.96) 32.04,21.08 C21.2 ; U5.31 28.57,25.25 28.62,25.19 28.98,25.19 v3(29.43,24.75)
  Inner2 w0.203: v3(29.43,24.75) 30.55,24.75 32.03,23.27 32.03,20.97 v3(32.04,20.96)
$1N24539: length 4.1
  Inner1 w0.203: v3(30.37,35.82) 30.28,35.9 v3(30.28,39.9)
$1N24972: length 3.6
  Top Layer w0.203: LED1.1 33.41,12.76 R12.2
$1N24975: length 1.9
  Top Layer w0.203: LED1.2 32.76,13.79 32.21,14.35 R13.2
$1N24978: length 2.2
  Top Layer w0.203: 32.88,14.59 31.65,15.82 R14.2
$1N56819: length 2.1
  Top Layer w0.203: R20.2 25.32,32.43 25.32,34.02 25.26,34.07 Typec.4
$1N56836: length 2.8
  Top Layer w0.203: R19.2 20.91,32.39 22.26,33.74 Typec.10
$1N59535: length 7.9
  Top Layer w0.203: R22.2 9.61,11.18 Q1.1 9.81,10.05 12.23,10.05 12.49,10.32 14.02,10.32 14.68,9.67 R21.2
$1N64086: length 1.8
  Top Layer w0.25: R25.2 13.8,17.86 U63.5

## Copper pours and planes (outline as drawn; the poured copper is in the pictures)
GND on Top Layer: -11.58,53.67 53.65,53.67 53.65,-3.81 -11.58,-3.81
GND on Bottom Layer: -19.23,59.02 52.99,59.02 52.99,-10.24 -19.23,-10.24
GND on Inner1: -8.47,50.05 51.05,50.05 51.05,-4.83 -8.47,-4.83
GND on Inner2: -6.63,47.04 49.52,47.04 49.52,-4.93 -6.63,-4.93

Small or netless copper shapes (teardrops, artwork), in the pictures only: 304 on Top Layer, 72 on Bottom Layer, 41 on Inner1, 35 on Inner2
